# Altium schematic sheet Power_Management.SchDoc
size A4; DrawnBy: Hanif; DocumentNumber: 4; SheetNumber: 4; SheetTotal: 8
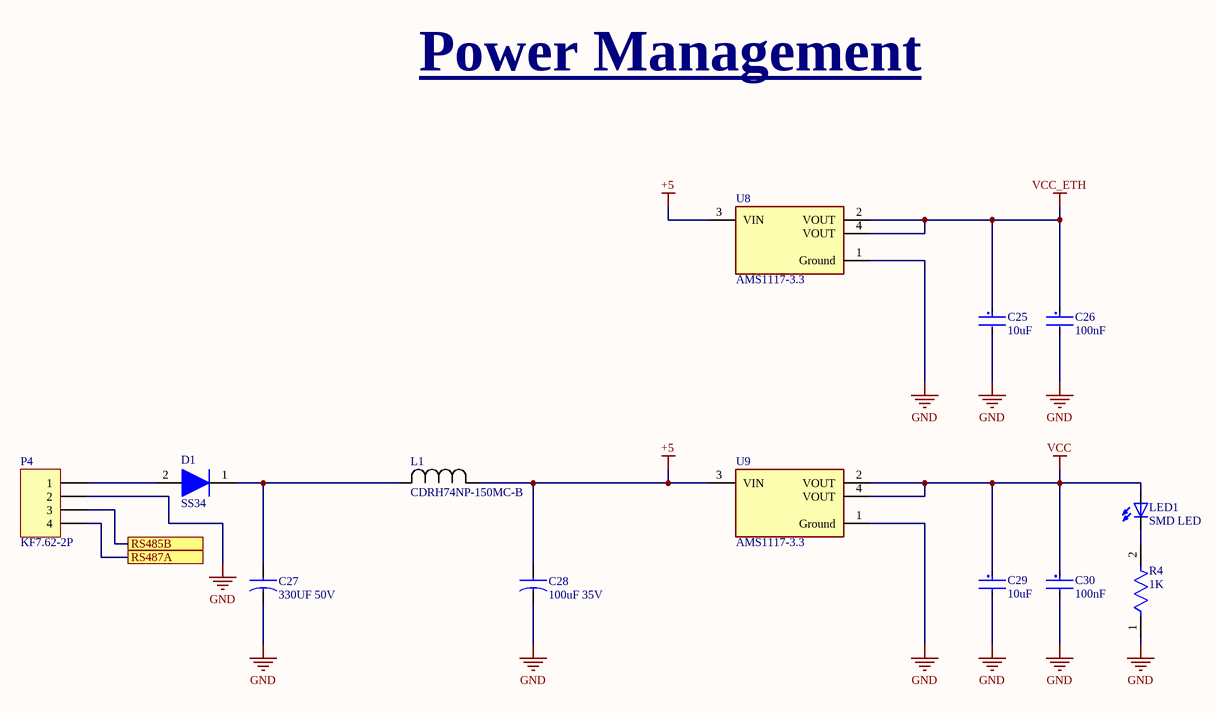
[diagram p0: Power_Management.SchDoc]

## Parts
C25  10uF  [Samsung_CL31_IPC_A_1206]
C26  100nF  [Samsung_CL31_IPC_A_1206]
C27  330UF 50V  [CAP_PAN_EEE_D8_PAN]
C28  100uF 35V  [CAP_PAN_EEE_D8_PAN]
C29  10uF  [Samsung_CL31_IPC_A_1206]
C30  100nF  [Samsung_CL31_IPC_A_1206]
D1  SS34  [SMA (DO-214AC)]
L1  CDRH74NP-150MC-B  [IND_CDRH74_SUM]
LED1  SMD LED  [1206_Inductor]
P4  KF7.62-2P  [KF6.5-4P Barrier Terminal Block]
R4  1K  [YAGEO_RC1206-0_65_IPC_A]
U8  AMS1117-3.3  [Advanced_Monolithic_Systems_AMS1117_IPC_A]
U9  AMS1117-3.3  [Advanced_Monolithic_Systems_AMS1117_IPC_A]

## Ports
RS485B, RS487A

## Nets
+5: C28.1 L1.1 U8.3(VIN) U9.3(VIN)
GND: C25.2 C26.2 C27.2 C28.2 C29.2 C30.2 P4.2 R4.1 U8.1(Ground) U9.1(Ground)
VCC: C29.1 C30.1 LED1.1 U9.2(VOUT) U9.4(VOUT)
VCC_ETH: C25.1 C26.1 U8.2(VOUT) U8.4(VOUT)
RS485B: P4.3 ; port RS485B
RS487A: P4.4 ; port RS487A
NetC27_1: C27.1 D1.1(K) L1.2
NetD1_2: D1.2(A) P4.1
NetLED1_2: LED1.2 R4.2

## Notes on the sheet
- Power Management
- Project Name:
- Size:
- Date:
- A4
- Doc Num:
- Time:
- Version:
- Sheet
- of
- File:
- Drawn by:

## Library data of the parts
C25 C29 = CL31A106KQHNNWE: CAP CER 10UF 6.3V X5R 1206, ±10% 6.3V Ceramic Capacitor X5R 1206 (3216 Metric); Supplier 1: Digi-Key; Supplier Part Number 1: 1276-3043-1-ND
C26 C30 = CL31B104KBCNFNC: CAP CER 0.1UF 50V X7R 1206, ±10% 50V Ceramic Capacitor X7R 1206 (3216 Metric); Supplier 1: Digi-Key; Supplier Part Number 1: 1276-2744-1-ND
C27 = 330 uF 50 V Electrolytic Capacitors: Aluminum Electrolytic Capacitors Radial, Can - 10000 Hrs @ 105°C; Manufacturer: Rubycon; Manufacturer Part Number: 50YXJ330M10X20; Tolerance: 20%; Ripple Current: 1.22A; Impedance: 60mR; Life (Hours): 10000Hour; Supplier 1: Digi-Key; RoHS: Yes; Category: Aluminum Electrolytic Capacitors; Stock 1: 72; Pricing 1: 1=0.82000, 10=0.57600, 50=0.43560, 100=0.37940, 500=0.28106, 1000=0.23890, 2500=0.22485, 5000=0.21080 (USD); Mount: Through Hole; Case/Package: Radial; Min Operating Temperature: -40°C; Max Operating Temperature: 105°C; Capacitance: 330uF; Termination: Radial; Package Quantity: 1000; Voltage Rating: 50V; Packaging: Bulk; Voltage Rating (DC): 50V; Series: YXJ; Diameter: 10mm; Height: 20mm; Lead Pitch: 5mm; Height - Seated (Max): 0.866inch; Radiation Hardening: No; REACH SVHC: No SVHC; RoHS Compliant: Yes; ComponentLink1URL: https://datasheet.ciiva.com/46371/1657883-46371898.pdf?src-supplier=Element14; ComponentLink1Description: https://datasheet.ciiva.com/46371/1657883-46371898.pdf?src-supplier=Element14; ComponentLink2URL: https://datasheet.ciiva.com/17513/e-yxj-17513675.pdf?src-supplier=Avnet+Europe; ComponentLink2Description: https://datasheet.ciiva.com/17513/e-yxj-17513675.pdf?src-supplier=Avnet+Europe; Supplier Part Number 1: 1189-1424-ND
C28 = 100 uF 35 V Electrolytic Capacitors Radial: Aluminum Electrolytic Capacitors Radial, Can - 1000 Hrs @ 105°C; Manufacturer: Panasonic; Manufacturer Part Number: EEU-HD1V101; Tolerance: 20%; Ripple Current: 150mA; Life (Hours): 1000Hour; Lead/Base Style: Straight; Polarity: Polar; Lead Diameter: 0.5mm; Supplier 1: Digi-Key; RoHS: Yes; Category: Aluminum Electrolytic Capacitors; Pricing 1: 1=0.85000, 10=0.60000, 50=0.45340, 100=0.39500, 500=0.29256, 1000=0.24868, 2500=0.23405, 5000=0.21942 (USD); Mount: Through Hole; Case/Package: Radial; Number of Pins: 2; Min Operating Temperature: -55°C; Max Operating Temperature: 105°C; Capacitance: 100uF; Packaging: Bulk; Voltage Rating: 35V; Package Quantity: 200; Voltage Rating (DC): 35V; Termination: Radial; Ripple Current (AC): 150mA; Voltage: 35V; Series: HD; Construction: RADIAL; Diameter: 6.3mm; Length: 11.2mm; Height: 11.2mm; Lead Pitch: 2.5mm; Height - Seated (Max): 0.5inch; Radiation Hardening: No; REACH SVHC: No SVHC; Lead Free: Lead Free; RoHS Compliant: Yes; ComponentLink1URL: https://datasheet.ciiva.com/11779/0900766b80fe5b03-11779839.pdf?src-supplier=RSComponents; ComponentLink1Description: https://datasheet.ciiva.com/11779/0900766b80fe5b03-11779839.pdf?src-supplier=RSComponents; Supplier Part Number 1: P15169-ND
D1 = 1N5819RLG: Rectifier, 2-Pin Axial_Lead, Pb-Free, Tape and Reel; Manufacturer: On Semiconductor; IFSM Max (A): 25; Configuration: Single; ComponentLink1Description: Manufacturer URL; ComponentLink2Description: Datasheet; ComponentLink3Description: Package Specification; Mounting Technology: Through Hole; ComponentLink3URL: http://www.onsemi.cn/pub_link/Collateral/59-10.PDF; DatasheetVersion: Rev. 10; ComponentLink1URL: http://www.onsemi.com/; Packing: Tape and Reel; PackageVersion: Rev. U, 02/2005; PartNumber: 1N5819RLG; PackageDescription: 2-Pin, Axial Lead, Diameter 2.35 mm; ComponentLink2URL: http://www.onsemi.cn/pub_link/Collateral/1N5817-D.PDF; RoHS: TRUE; PackageReference: AXIAL_LEAD-2-59-10; Supplier 1: Newark; Supplier Part Number 1: 18C9038
L1 = CDRH74NP-150MC-B: No Description Available; Mfr_Name: Sumida; Type: DEV; Copyright: Copyright (C) 2022 Ultra Librarian. All rights reserved.; Manufacturer_Part_Number: CDRH74NP-150MC-B; RefDes: RefDes
LED1 = TLLG4400: Green 569nm LED Indication - Discrete 1.9V Radial; MF: Vishay; MP: TLLG4400; Package: Radial Vishay; Value: *; Digi-Key_Purchase_URL: https://www.digikey.com.tr/product-detail/en/vishay-semiconductor-opto-division/TLLG4400-AS12/TLLG4400-AS12TR-ND/6594860?utm_source=snapeda&utm_medium=aggregator&utm_campaign=symbol; Digi-Key_Part_Number: TLLG4400-AS12TR-ND; SnapEDA_Link: https://www.snapeda.com/parts/TLLG4400/Vishay/view-part/268070/?ref=snap
P4 = KF6.5-4P Barrier Terminal Block: KF7.62-2P Barrier Terminal Block, 7.62mm spacing barrier terminals with side expandable slot. The terminal accepts wire gauge of 22~12AWG. Connectors are available black PA66 material.
R4 = RC1206JR-071KL: 1 ±5% 0.25W, 1/4W Chip Resistor 1206 (3216 Metric) Moisture Resistant Thick Film; Supplier 1: Digi-Key; Supplier Part Number 1: 311-1.0KERCT-ND
U8 U9 = AMS1117-3.3: Fixed 15V 3.3V 1.3V @ 800mA SOT-223 Dropout Regulators(LDO) RoHS